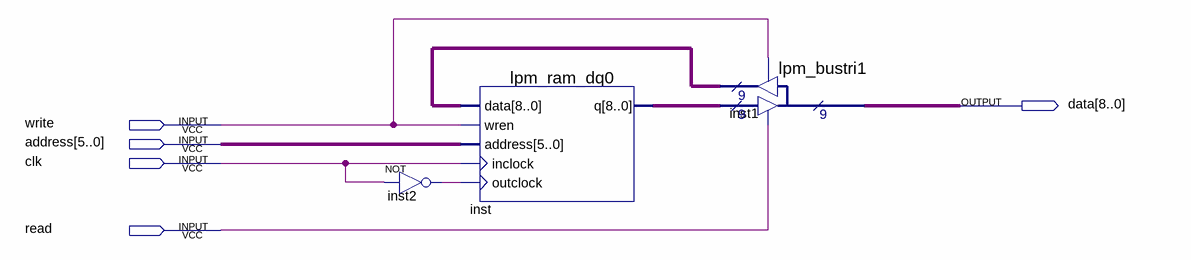
[diagram p0: schematic sheet]
// Quartus schematic ram.bdf as structural Verilog: 3 symbols, 5 pins
module ram (
  input  write,
  input  [5:0] address,
  input  clk,
  input  read,
  output [8:0] data
);

  wire inst2_out;
  wire [8:0] inst1_result, inst_q;

  not inst2 (inst2_out, clk);
  lpm_ram_dq0 inst (
    .data(inst1_result), .wren(write), .address(address), .inclock(clk), .outclock(inst2_out), .q(inst_q));
  lpm_bustri1 inst1 (.enabledt(read), .data(inst_q), .enabletr(write), .result(inst1_result), .tridata(data));
endmodule
